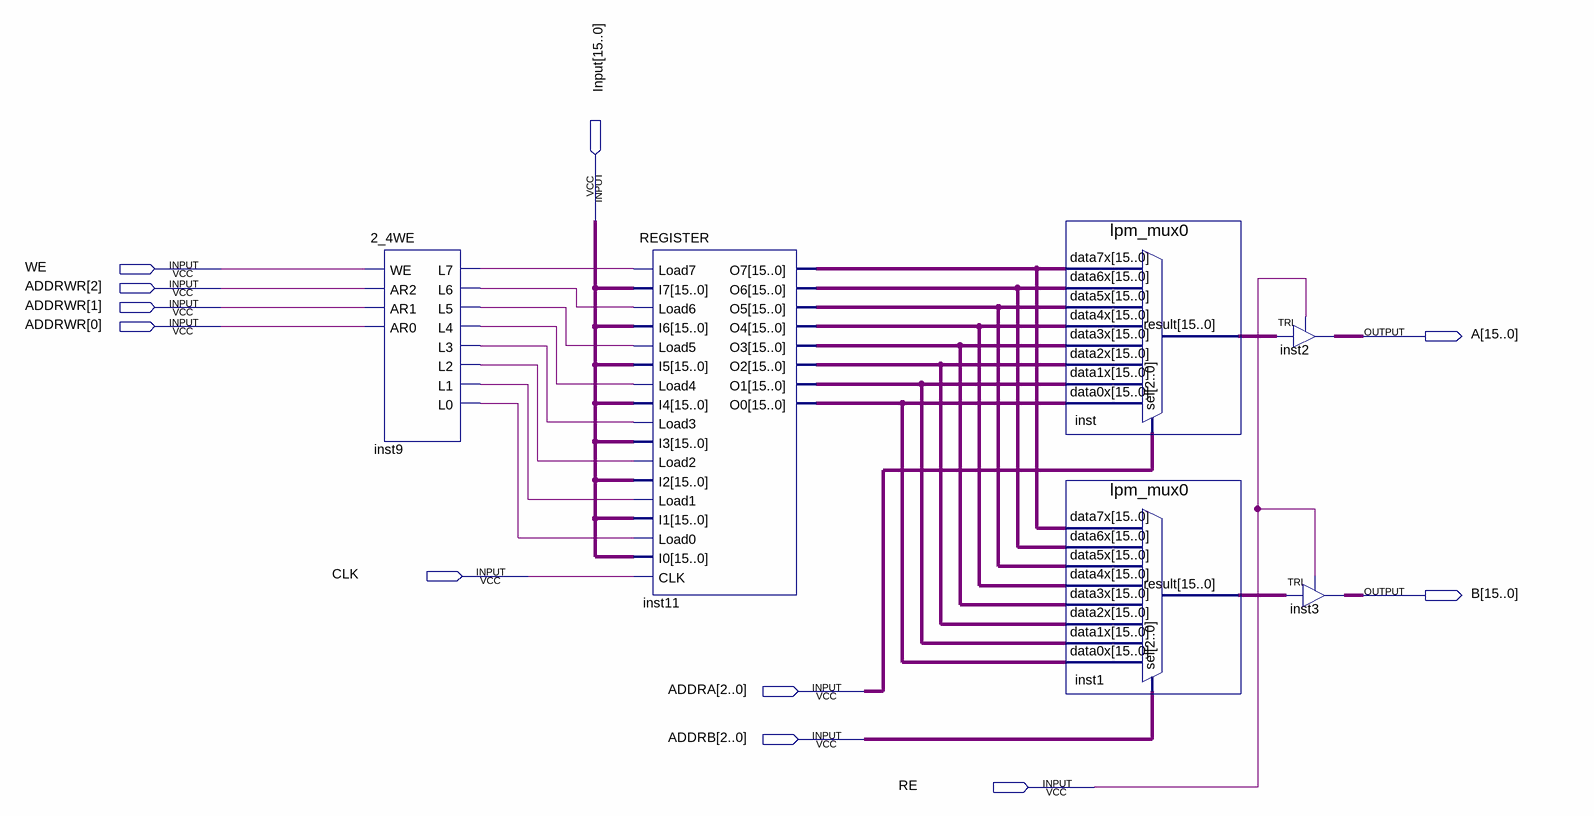
[diagram p0: schematic sheet]
// Quartus schematic Register_File.bdf as structural Verilog: 6 symbols, 11 pins
module Register_File (
  input  [15:0] Input,
  input  WE,
  input  [2:0] ADDRWR,
  input  CLK,
  input  [2:0] ADDRA,
  input  [2:0] ADDRB,
  input  RE,
  output [15:0] A,
  output [15:0] B
);

  wire inst9_l0, inst9_l1, inst9_l2, inst9_l3, inst9_l4, inst9_l5, inst9_l6, inst9_l7;
  wire [15:0] inst1_result, inst11_o0, inst11_o1, inst11_o2, inst11_o3, inst11_o4, inst11_o5, inst11_o6,
       inst11_o7, inst_result;

  \2_4WE  inst9 (
    .WE(WE), .AR2(ADDRWR[2]), .AR1(ADDRWR[1]), .AR0(ADDRWR[0]), .L7(inst9_l7), .L6(inst9_l6), .L5(inst9_l5),
    .L4(inst9_l4), .L3(inst9_l3), .L2(inst9_l2), .L1(inst9_l1), .L0(inst9_l0));
  REGISTER inst11 (
    .Load7(inst9_l7), .I7(Input), .Load6(inst9_l6), .I6(Input), .Load5(inst9_l5), .I5(Input),
    .Load4(inst9_l4), .I4(Input), .Load3(inst9_l3), .I3(Input), .Load2(inst9_l2), .I2(Input),
    .Load1(inst9_l1), .I1(Input), .Load0(inst9_l0), .I0(Input), .CLK(CLK), .O7(inst11_o7), .O6(inst11_o6),
    .O5(inst11_o5), .O4(inst11_o4), .O3(inst11_o3), .O2(inst11_o2), .O1(inst11_o1), .O0(inst11_o0));
  lpm_mux0 inst (
    .data7x(inst11_o7), .data6x(inst11_o6), .data5x(inst11_o5), .data4x(inst11_o4), .data3x(inst11_o3),
    .data2x(inst11_o2), .data1x(inst11_o1), .data0x(inst11_o0), .sel(ADDRA), .result(inst_result));
  lpm_mux0 inst1 (
    .data7x(inst11_o7), .data6x(inst11_o6), .data5x(inst11_o5), .data4x(inst11_o4), .data3x(inst11_o3),
    .data2x(inst11_o2), .data1x(inst11_o1), .data0x(inst11_o0), .sel(ADDRB), .result(inst1_result));
  TRI inst2[15:0] (.IN(inst_result), .OE(RE), .OUT(A));
  TRI inst3[15:0] (.IN(inst1_result), .OE(RE), .OUT(B));
endmodule
